# Altium schematic sheet 06_Communication.SchDoc
size A4; Author: Ganghyeok Lim; Revision: B; SheetNumber: 7; SheetTotal: 7
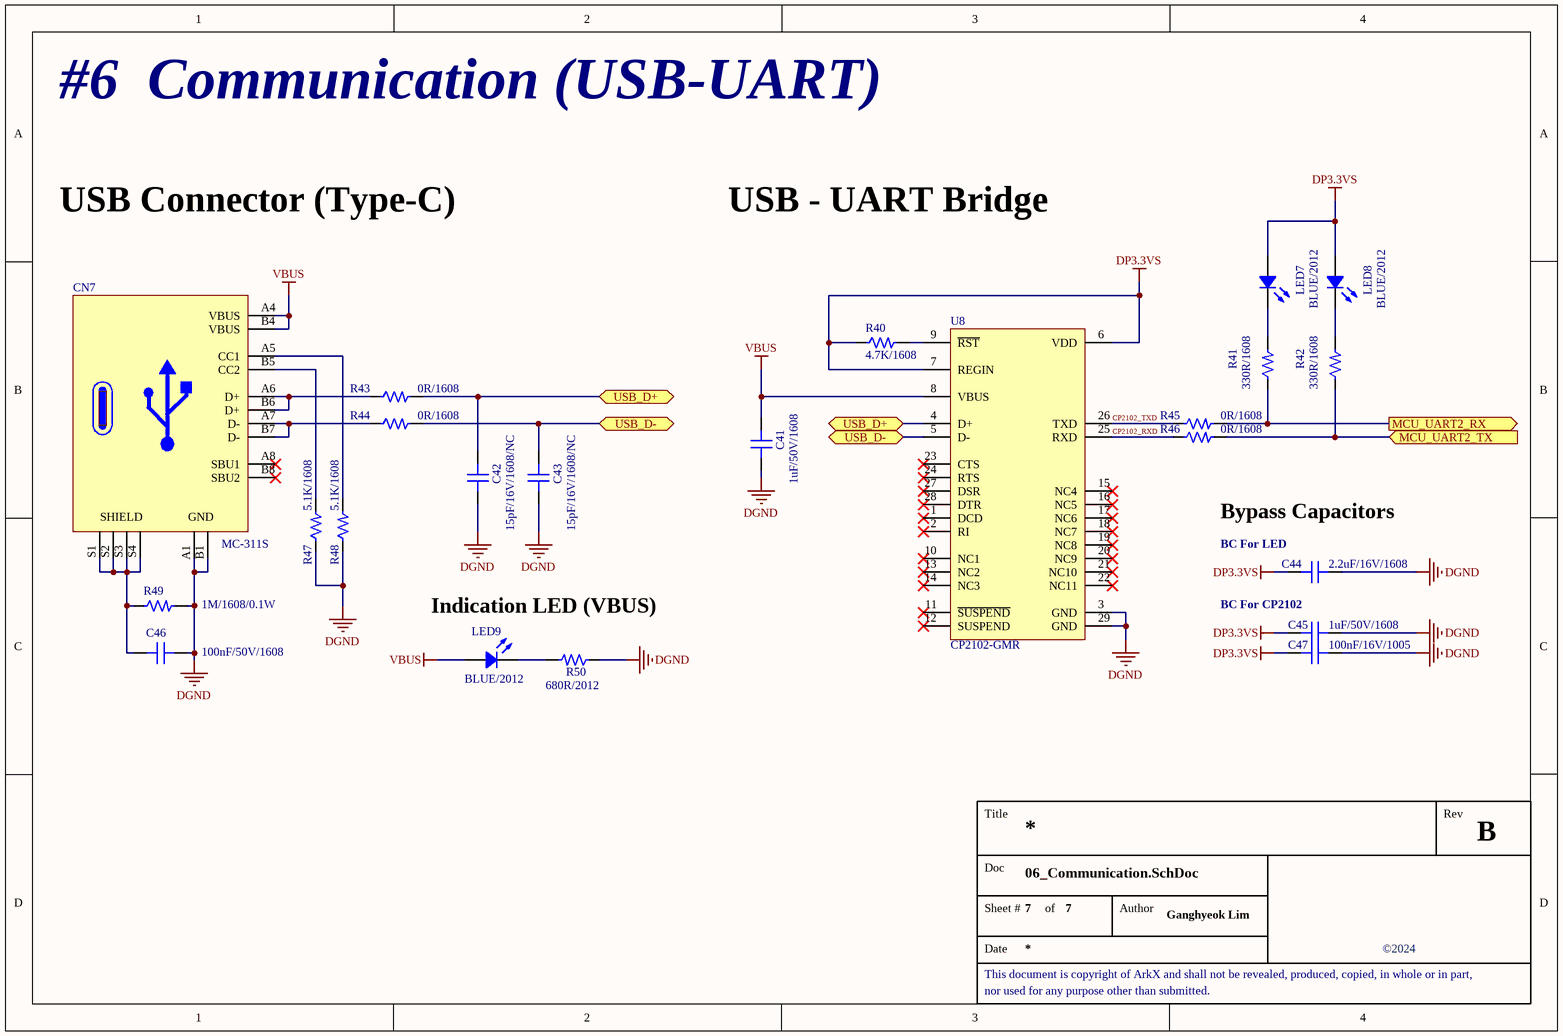
[diagram p0: 06_Communication.SchDoc]

## Parts
C41  1uF/50V/1608  [CAP 1608 (0603_INCH)]
C42  15pF/16V/1608/NC  [CAP 1608 (0603_INCH)/NC]
C43  15pF/16V/1608/NC  [CAP 1608 (0603_INCH)/NC]
C44  2.2uF/16V/1608  [CAP 1608 (0603_INCH)]
C45  1uF/50V/1608  [CAP 1608 (0603_INCH)]
C46  100nF/50V/1608  [CAP 1608 (0603_INCH)]
C47  100nF/16V/1005  [CAP 1005 (0402_INCH)]
CN7  MC-311S  [CON USB-Type-C (16P)]
LED7  BLUE/2012  [LED MHT170RGBCT (BLUE)]
LED8  BLUE/2012  [LED MHT170RGBCT (BLUE)]
LED9  BLUE/2012  [LED MHT170RGBCT (BLUE)]
R40  4.7K/1608  [RES 1608 (0603_inch)]
R41  330R/1608  [RES 1608 (0603_inch)]
R42  330R/1608  [RES 1608 (0603_inch)]
R43  0R/1608  [RES 1608 (0603_inch)]
R44  0R/1608  [RES 1608 (0603_inch)]
R45  0R/1608  [RES 1608 (0603_inch)]
R46  0R/1608  [RES 1608 (0603_inch)]
R47  5.1K/1608  [RES 1608 (0603_inch)]
R48  5.1K/1608  [RES 1608 (0603_inch)]
R49  1M/1608/0.1W  [RES 1608 (0603_inch)]
R50  680R/2012  [RES 2012 (0805_inch)]
U8  CP2102-GMR  [QFN-28 (5x5mm)]

## Ports
MCU_UART2_RX (out), MCU_UART2_TX (in), USB_D+ (bidir), USB_D- (bidir)

## Nets
DGND: C41.1 C42.1 C43.1 C44.2 C45.1 C46.2 C47.1 CN7.A1(GND) CN7.B1(GND) R47.1 R48.1 R49.2 R50.1 U8.3(GND) U8.29(GND)
DP3.3VS: C44.1 C45.2 C47.2 LED7.4(Common_Anode) LED8.4(Common_Anode) R40.1 U8.6(VDD) U8.7(REGIN)
VBUS: C41.2 CN7.A4(VBUS) CN7.B4(VBUS) LED9.4(Common_Anode) U8.8(VBUS)
CP2102_RXD: R46.1 U8.25(RXD)
CP2102_TXD: R45.1 U8.26(TXD)
MCU_UART2_RX: R41.1 R45.2 ; port MCU_UART2_RX
MCU_UART2_TX: R42.1 R46.2 ; port MCU_UART2_TX
USB_D+: C42.2 R43.2 U8.4(D+) ; port USB_D+
USB_D-: C43.2 R44.2 U8.5(D-) ; port USB_D-
NetC46_1: C46.1 CN7.S1(SHIELD) CN7.S2(SHIELD) CN7.S3(SHIELD) CN7.S4(SHIELD) R49.1
NetCN7_A5: CN7.A5(CC1) R48.2
NetCN7_A6: CN7.A6(D+) CN7.B6(D+) R43.1
NetCN7_A7: CN7.A7(D-) CN7.B7(D-) R44.1
NetCN7_B5: CN7.B5(CC2) R47.2
NetLED7_3: LED7.3(BLUE) R41.2
NetLED8_3: LED8.3(BLUE) R42.2
NetLED9_3: LED9.3(BLUE) R50.2
NetR40_2: R40.2 U8.9(~{RST})

Not connected (* = marked no-connect by the designer): CN7 A8(SBU1)* B8(SBU2)*; U8 1(DCD)* 2(RI)* 10(NC1)* 11(~{SUSPEND})* 12(SUSPEND)* 13(NC2)* 14(NC3)* 15(NC4)* 16(NC5)* 17(NC6)* 18(NC7)* 19(NC8)* 20(NC9)* 21(NC10)* 22(NC11)* 23(CTS)* 24(RTS)* 27(DSR)* 28(DTR)*

## Notes on the sheet
- #6  Communication (USB-UART)
- USB Connector (Type-C)
- USB - UART Bridge
- Bypass Capacitors
- (near C44) BC For LED
- Indication LED (VBUS)
- BC For CP2102
- Title
- Rev
- Doc
- Sheet #
- of
- Author
- This document is copyright of ArkX and shall not be revealed, produced, copied, in whole or in part,
- Date
- ©2024
- nor used for any purpose other than submitted.

## Library data of the parts
C41 C45 = CAP_1uF/50V/1608: Ceramic CAP_1uF/50V/1608; LCSC Part #: C15849; JLCPCB Part Type: Basic Part
C42 C43 = CAP_NC_15pF/16V/1608: Ceramic CAP_15pF/16V/1608
C44 = CAP_2.2uF/16V/1608: Ceramic CAP_2.2uF/16V/1608; LCSC Part #: C23630; JLCPCB Part Type: Basic Part
C46 = CAP_100nF/50V/1608: Ceramic CAP_100nF/50V/1608; LCSC Part #: C14663; JLCPCB Part Type: Basic Part
C47 = CAP_100nF/16V/1005: Ceramic CAP_100nF/16V/1005; LCSC Part #: C1525; JLCPCB Part Type: Basic Part
CN7 = CON_USB-Type-C: USB 2.0 5A 1 Surface Mount 16 Female -35℃~+75℃ Type-C SMD  USB Connectors ROHS; LCSC Part #: C2977718; JLCPCB Part Type: Extended Part
LED7-LED9 = LED_MHT170RGBCT(BLUE): Colorless transparence -30℃~+85℃ Positive post Common anode RGB 120° 0805  Light Emitting Diodes (LED) ROHS; LCSC Part #: C2962094; JLCPCB Part Type: Extended Part
R40 = RES_4.7K/1608/0.1W: Value: 4.7K; Power Rating: 0.1W; Precision: 1%; Size: 1608; LCSC Part #: C23162; JLCPCB Part Type: Basic Part
R41 R42 = RES_330R/1608/0.1W: Value: 330R; Power Rating: 0.1W; Precision: 1%; Size: 1608; LCSC Part #: C23138; JLCPCB Part Type: Basic Part
R43-R46 = RES_0R/1608/0.1W: Value: 0R; Power Rating: 0.1W; Precision: 1%; Size: 1608; LCSC Part #: C21189; JLCPCB Part Type: Basic Part
R47 R48 = RES_5.1K/1608/0.1W: Value: 5.1K; Power Rating: 0.1W; Precision: 1%; Size: 1608; LCSC Part #: C23186; JLCPCB Part Type: Basic Part
R49 = RES_1M/1608/0.1W: Value: 1M; Power Rating: 0.1W; Precision: 1%; Size: 1608; LCSC Part #: C22935; JLCPCB Part Type: Basic Part
R50 = RES_680R/2012/0.125W: Value: 680R; Power Rating: 0.125W; Precision: 1%; Size: 2012; LCSC Part #: C17798; JLCPCB Part Type: Basic Part
U8 = IC_USB_CP2102: Transceiver 1Mbps USB 1/1 QFN-28_5x5x05P  USB ICs ROHS; LCSC Part #: C6568; JLCPCB Part Type: Basic Part